# EAGLE schematic Sequencer (EAGLE 9.3.0)
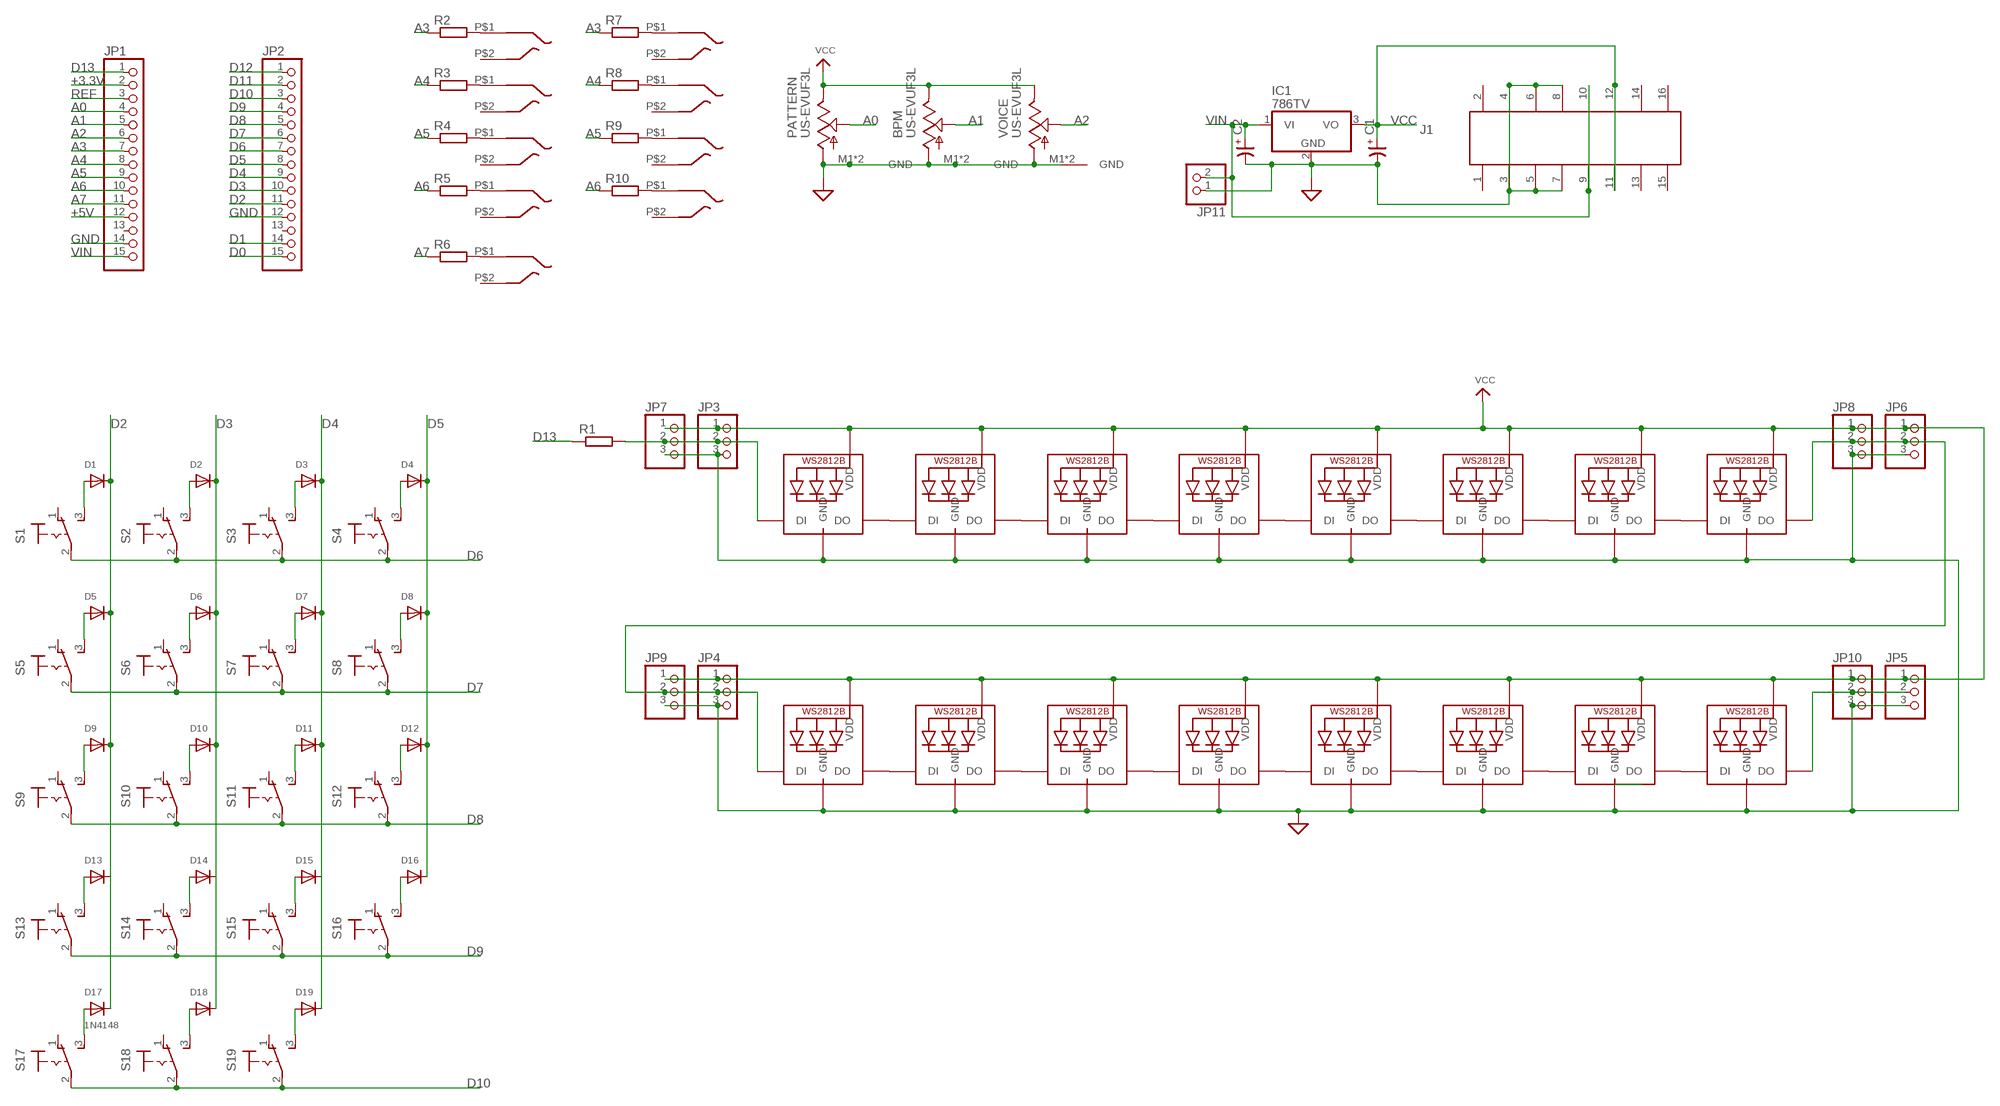
[diagram p0: schematic, sheet 1]

## Parts
BPM  US-EVUF3L  [7.5MM]
C1  CP-E-025X065  [E-025X065]
C2  CP-E-025X065  [E-025X065]
D1  DIODEDO-1N4148  [DO-1N4148]
D2  DIODEDO-1N4148  [DO-1N4148]
D3  DIODEDO-1N4148  [DO-1N4148]
D4  DIODEDO-1N4148  [DO-1N4148]
D5  DIODEDO-1N4148  [DO-1N4148]
D6  DIODEDO-1N4148  [DO-1N4148]
D7  DIODEDO-1N4148  [DO-1N4148]
D8  DIODEDO-1N4148  [DO-1N4148]
D9  DIODEDO-1N4148  [DO-1N4148]
D10  DIODEDO-1N4148  [DO-1N4148]
D11  DIODEDO-1N4148  [DO-1N4148]
D12  DIODEDO-1N4148  [DO-1N4148]
D13  DIODEDO-1N4148  [DO-1N4148]
D14  DIODEDO-1N4148  [DO-1N4148]
D15  DIODEDO-1N4148  [DO-1N4148]
D16  DIODEDO-1N4148  [DO-1N4148]
D17  1N4148  DIODEDO-1N4148  [DO-1N4148]
D18  DIODEDO-1N4148  [DO-1N4148]
D19  DIODEDO-1N4148  [DO-1N4148]
IC1  786TV  [TO220V]
J1  61201622323  [61201622323]
JP1  PINHD-1X15  [1X15]
JP2  PINHD-1X15  [1X15]
JP3  PINHD-1X3CB  [1X03-CLEANBIG]
JP4  PINHD-1X3CB  [1X03-CLEANBIG]
JP5  PINHD-1X3CB  [1X03-CLEANBIG]
JP6  PINHD-1X3CB  [1X03-CLEANBIG]
JP7  PINHD-1X3CB  [1X03-CLEANBIG]
JP8  PINHD-1X3CB  [1X03-CLEANBIG]
JP9  PINHD-1X3CB  [1X03-CLEANBIG]
JP10  PINHD-1X3CB  [1X03-CLEANBIG]
JP11  PINHD-1X2  [1X02]
LED1  WS2812B5050  [WS2812B]
LED2  WS2812B5050  [WS2812B]
LED3  WS2812B5050  [WS2812B]
LED4  WS2812B5050  [WS2812B]
LED5  WS2812B5050  [WS2812B]
LED6  WS2812B5050  [WS2812B]
LED7  WS2812B5050  [WS2812B]
LED8  WS2812B5050  [WS2812B]
LED9  WS2812B5050  [WS2812B]
LED10  WS2812B5050  [WS2812B]
LED11  WS2812B5050  [WS2812B]
LED12  WS2812B5050  [WS2812B]
LED13  WS2812B5050  [WS2812B]
LED14  WS2812B5050  [WS2812B]
LED15  WS2812B5050  [WS2812B]
LED16  WS2812B5050  [WS2812B]
PATTERN  US-EVUF3L  [7.5MM]
R1  R-EU_0207/10  [0207/10]
R2  R-EU_0207/10  [0207/10]
R3  R-EU_0207/10  [0207/10]
R4  R-EU_0207/10  [0207/10]
R5  R-EU_0207/10  [0207/10]
R6  R-EU_0207/10  [0207/10]
R7  R-EU_0207/10  [0207/10]
R8  R-EU_0207/10  [0207/10]
R9  R-EU_0207/10  [0207/10]
R10  R-EU_0207/10  [0207/10]
S1  CHINESIUM-TOGGLE-SWITCH  [CHINESIUM-TOGGLE-SWITCH]
S2  CHINESIUM-TOGGLE-SWITCH  [CHINESIUM-TOGGLE-SWITCH]
S3  CHINESIUM-TOGGLE-SWITCH  [CHINESIUM-TOGGLE-SWITCH]
S4  CHINESIUM-TOGGLE-SWITCH  [CHINESIUM-TOGGLE-SWITCH]
S5  CHINESIUM-TOGGLE-SWITCH  [CHINESIUM-TOGGLE-SWITCH]
S6  CHINESIUM-TOGGLE-SWITCH  [CHINESIUM-TOGGLE-SWITCH]
S7  CHINESIUM-TOGGLE-SWITCH  [CHINESIUM-TOGGLE-SWITCH]
S8  CHINESIUM-TOGGLE-SWITCH  [CHINESIUM-TOGGLE-SWITCH]
S9  CHINESIUM-TOGGLE-SWITCH  [CHINESIUM-TOGGLE-SWITCH]
S10  CHINESIUM-TOGGLE-SWITCH  [CHINESIUM-TOGGLE-SWITCH]
S11  CHINESIUM-TOGGLE-SWITCH  [CHINESIUM-TOGGLE-SWITCH]
S12  CHINESIUM-TOGGLE-SWITCH  [CHINESIUM-TOGGLE-SWITCH]
S13  CHINESIUM-TOGGLE-SWITCH  [CHINESIUM-TOGGLE-SWITCH]
S14  CHINESIUM-TOGGLE-SWITCH  [CHINESIUM-TOGGLE-SWITCH]
S15  CHINESIUM-TOGGLE-SWITCH  [CHINESIUM-TOGGLE-SWITCH]
S16  CHINESIUM-TOGGLE-SWITCH  [CHINESIUM-TOGGLE-SWITCH]
S17  CHINESIUM-TOGGLE-SWITCH  [CHINESIUM-TOGGLE-SWITCH]
S18  CHINESIUM-TOGGLE-SWITCH  [CHINESIUM-TOGGLE-SWITCH]
S19  CHINESIUM-TOGGLE-SWITCH  [CHINESIUM-TOGGLE-SWITCH]
U$1  3.5MM-AUDIO  [3.5MM-AUDIO]
U$2  3.5MM-AUDIO  [3.5MM-AUDIO]
U$3  3.5MM-AUDIO  [3.5MM-AUDIO]
U$4  3.5MM-AUDIO  [3.5MM-AUDIO]
U$5  3.5MM-AUDIO  [3.5MM-AUDIO]
U$6  3.5MM-AUDIO  [3.5MM-AUDIO]
U$7  3.5MM-AUDIO  [3.5MM-AUDIO]
U$8  3.5MM-AUDIO  [3.5MM-AUDIO]
U$9  3.5MM-AUDIO  [3.5MM-AUDIO]
VOICE  US-EVUF3L  [7.5MM]

## Nets
+3.3V: JP1.2
+5V: JP1.12
A0: JP1.4 PATTERN.2(S)
A1: BPM.2(S) JP1.5
A2: JP1.6 VOICE.2(S)
A3: JP1.7 R2.1 R7.1
A4: JP1.8 R3.1 R8.1
A5: JP1.9 R4.1 R9.1
A6: JP1.10 R5.1 R10.1
A7: JP1.11 R6.1
D0: JP2.15
D1: JP2.14
D2: D1.C D5.C D9.C D13.C D17.C JP2.11
D3: D2.C D6.C D10.C D14.C D18.C JP2.10
D4: D3.C D7.C D11.C D15.C D19.C JP2.9
D5: D4.C D8.C D12.C D16.C JP2.8
D6: JP2.7 S1.2(P) S2.2(P) S3.2(P) S4.2(P)
D7: JP2.6 S5.2(P) S6.2(P) S7.2(P) S8.2(P)
D8: JP2.5 S9.2(P) S10.2(P) S11.2(P) S12.2(P)
D9: JP2.4 S13.2(P) S14.2(P) S15.2(P) S16.2(P)
D10: JP2.3 S17.2(P) S18.2(P) S19.2(P)
D11: JP2.2
D12: JP2.1
D13: JP1.1 R1.1
GND: BPM.1(A) BPM.M1(GND) BPM.M2(GND) C1.- C2.- IC1.2(GND) J1.3 J1.4 J1.5 J1.6 J1.7 J1.8 JP1.14 JP2.12 JP3.3 JP4.3 JP5.3 JP6.3 JP7.3 JP8.3 JP9.3 JP10.3 JP11.1 LED1.3-GND(GND) LED2.3-GND(GND) LED3.3-GND(GND) LED4.3-GND(GND) LED5.3-GND(GND) LED6.3-GND(GND) LED7.3-GND(GND) LED8.3-GND(GND) LED9.3-GND(GND) LED10.3-GND(GND) LED11.3-GND(GND) LED12.3-GND(GND) LED13.3-GND(GND) LED14.3-GND(GND) LED15.3-GND(GND) LED16.3-GND(GND) PATTERN.1(A) PATTERN.M1(GND) PATTERN.M2(GND) VOICE.1(A) VOICE.M1(GND) VOICE.M2(GND) ; supply symbol labelled SUP
N$1: D17.A S17.3(S)
N$2: D18.A S18.3(S)
N$3: D19.A S19.3(S)
N$4: R2.2 U$1.P$1
N$5: D1.A S1.3(S)
N$6: D2.A S2.3(S)
N$7: D3.A S3.3(S)
N$8: D4.A S4.3(S)
N$9: D5.A S5.3(S)
N$10: D6.A S6.3(S)
N$11: D7.A S7.3(S)
N$12: D8.A S8.3(S)
N$13: D9.A S9.3(S)
N$14: D10.A S10.3(S)
N$15: D11.A S11.3(S)
N$16: D12.A S12.3(S)
N$17: D13.A S13.3(S)
N$18: D14.A S14.3(S)
N$19: D15.A S15.3(S)
N$20: D16.A S16.3(S)
N$21: R3.2 U$2.P$1
N$22: LED1.2-DOUT(DO) LED2.4-DIN(DI)
N$23: LED2.2-DOUT(DO) LED3.4-DIN(DI)
N$24: LED7.2-DOUT(DO) LED8.4-DIN(DI)
N$25: LED10.2-DOUT(DO) LED11.4-DIN(DI)
N$26: LED11.2-DOUT(DO) LED12.4-DIN(DI)
N$27: LED13.2-DOUT(DO) LED14.4-DIN(DI)
N$28: LED14.2-DOUT(DO) LED15.4-DIN(DI)
N$29: JP3.2 JP7.2 LED1.4-DIN(DI) R1.2
N$30: LED15.2-DOUT(DO) LED16.4-DIN(DI)
N$31: LED12.2-DOUT(DO) LED13.4-DIN(DI)
N$32: LED3.2-DOUT(DO) LED4.4-DIN(DI)
N$33: R4.2 U$3.P$1
N$34: R5.2 U$4.P$1
N$35: LED4.2-DOUT(DO) LED5.4-DIN(DI)
N$38: R6.2 U$5.P$1
N$39: JP4.2 JP6.2 JP8.2 JP9.2 LED8.2-DOUT(DO) LED9.4-DIN(DI)
N$40: LED5.2-DOUT(DO) LED6.4-DIN(DI)
N$41: LED9.2-DOUT(DO) LED10.4-DIN(DI)
N$42: LED6.2-DOUT(DO) LED7.4-DIN(DI)
N$43: R7.2 U$6.P$1
N$44: R8.2 U$7.P$1
N$45: JP5.2 JP10.2 LED16.2-DOUT(DO)
N$46: R9.2 U$8.P$1
N$48: R10.2 U$9.P$1
REF: JP1.3
VCC: BPM.3(E) C1.+ IC1.3(VO) J1.11 J1.12 JP3.1 JP4.1 JP5.1 JP6.1 JP7.1 JP8.1 JP9.1 JP10.1 LED1.1-VDD(VDD) LED2.1-VDD(VDD) LED3.1-VDD(VDD) LED4.1-VDD(VDD) LED5.1-VDD(VDD) LED6.1-VDD(VDD) LED7.1-VDD(VDD) LED8.1-VDD(VDD) LED9.1-VDD(VDD) LED10.1-VDD(VDD) LED11.1-VDD(VDD) LED12.1-VDD(VDD) LED13.1-VDD(VDD) LED14.1-VDD(VDD) LED15.1-VDD(VDD) LED16.1-VDD(VDD) PATTERN.3(E) VOICE.3(E)
VIN: C2.+ IC1.1(VI) J1.9 J1.10 JP1.15 JP11.2
Unconnected: J1.1 J1.2 J1.13 J1.14 J1.15 J1.16 JP1.13 JP2.13 S1.1(O) S2.1(O) S3.1(O) S4.1(O) S5.1(O) S6.1(O) S7.1(O) S8.1(O) S9.1(O) S10.1(O) S11.1(O) S12.1(O) S13.1(O) S14.1(O) S15.1(O) S16.1(O) S17.1(O) S18.1(O) S19.1(O) U$1.P$2 U$2.P$2 U$3.P$2 U$4.P$2 U$5.P$2 U$6.P$2 U$7.P$2 U$8.P$2 U$9.P$2

## Library data of the parts
BPM PATTERN VOICE = customPot:US-EVU: 9 mm Square Rotary Potentiometers Source: Panasonic
C1 C2 = cap-master:CP-: POLARIZED CAP
D1-D19 = adafruit:DIODE: Diode SMADIODE - SMA Surface Mount Package 20V 1A Schottky Diode Digikey: 641-1014-6-ND DO-1N4148 - Through Hole Small Current Diode SOD-123 20V 1 A (.5mV Vf) Schottky Diode - Digikey: MBRX120TPMSCT-ND SOD-323 10V 570mA (.38mV Vf, 3ns) Schottky Diode - Digikey: ZLLS410CT-ND SOD-523 30V 30mA Schottky Diode (RB751S-40TE61) - Digikey: RB751S-40TE61CT-ND SOT23-R/W - SOT23 Package (R = Solder Paste/Reflow Ovens, W = Hand-Soldering) BAT54Film 40V 300mA - Digikey: 497-7162-1-ND
IC1 = linear:78*: Positive VOLTAGE REGULATOR Source: http://cache.national.com/ds/LM/LM78L05.pdf http://www.fairchildsemi.com/ds/LM/LM7805.pdf
J1 = Wurth_Elektronik_Electromechanic_Wire_to_Board_Connectors_rev18a:61201622323: WR-BHD 2.54mm Board to Cable Transition Connector, 16 Pins=>Code : Con_WTB_IDC_61201622323 <http://katalog.we-online.de/media/thumbs2/eican/thb_Con_WTB_IDC_6120xx22323_pf2.jpg> Details see: http://katalog.we-online.de/en/em/612_0xx_223_23 Created 2014-06-05, Karrer Zheng 2014 (C) Würth Elektronik
JP1 JP2 = adafruit:PINHD-1X15: PIN HEADER
JP3-JP10 = adafruit:PINHD-1X3: PIN HEADER
JP11 = pinhead:PINHD-1X2: PIN HEADER
LED1-LED16 = adafruit:WS2812B
R1-R10 = resistor:R-EU_: RESISTOR, European symbol
S1-S19 = switch:CHINESIUM-TOGGLE-SWITCH: TOGGLE SWITCH distributor RS Components
U$1-U$9 = customStuff:3.5MM-AUDIO